# EAGLE schematic wheatstone (EAGLE 9.6.2)
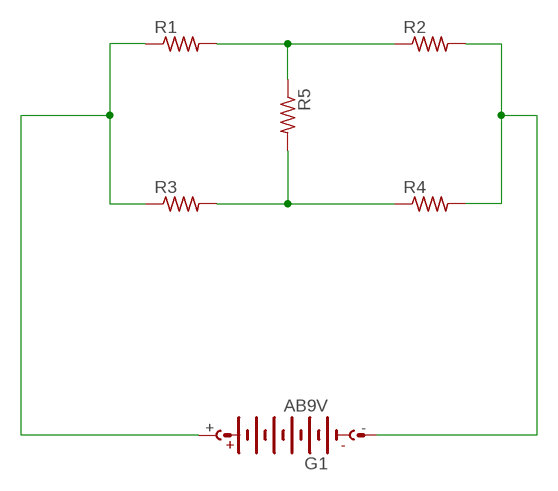
[diagram p0: schematic, sheet 1]

## Parts
G1  AB9V  [AB9V]
R1  R-US_R0603  [R0603]
R2  R-US_R0603  [R0603]
R3  R-US_R0603  [R0603]
R4  R-US_R0603  [R0603]
R5  R-US_R0603  [R0603]

## Nets
N$1: G1.+ R1.1 R3.1
N$2: R1.2 R2.1 R5.1
N$3: G1.- R2.2 R4.2
N$4: R3.2 R4.1 R5.2

## Library data of the parts
G1 = battery:AB9V: 9-V BATTERY CLIP
R1-R5 = rcl:R-US_: RESISTOR, American symbol; SPICEPREFIX: R